# EAGLE schematic SIMPLE_Radio_AT86RF (EAGLE 6.5.0)
Zigbee Wireless Radio: AT86RF AT86RF Family <http://www.atmel.com/Images/doc8168.pdf> This block includes all supply bypass capacitors and RF coupling capacitors. The IRQ pin is optional. It tells the microcontroller when a new message has arrived among other things. The /RST pin can either be tied to power or be controlled by a microcontroller. The current antenna design calls for a whip (cut wire) antenna of length 8.33cm for 900MHz or 3.1cm for 2.4GHz to be soldered into the jumper.
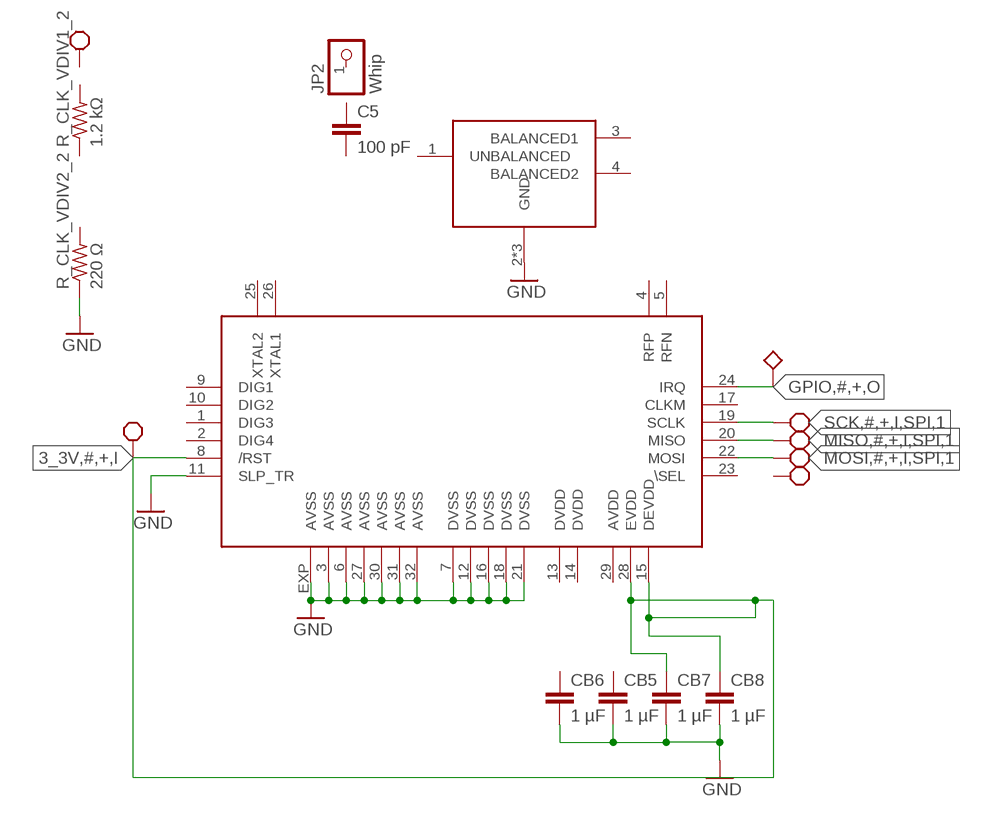
[diagram p0: schematic, sheet 1]

## Parts
BALUN2  0896FB15A0100  [0896FB15A0100]
C5  100 pF  C-EUC0402  [C0402]
CB5  1 µF  C-EUC0402  [C0402]
CB6  1 µF  C-EUC0402  [C0402]
CB7  1 µF  C-EUC0402  [C0402]
CB8  1 µF  C-EUC0402  [C0402]
JP2  Whip  PINHD-1X01_2.54-S  [1X01-S]
R_CLK_VDIV1_2  1.2 kΩ  R-US_R0402  [R0402]
R_CLK_VDIV2_2  220 Ω  R-US_R0402  [R0402]
U$51  AT86RF  [QFNN32]

## Nets
3_3V,#,+,I: CB7.1 CB8.1 U$51.8(/RST) U$51.15(DEVDD) U$51.28(EVDD) ; supply symbol labelled BLOCK_REQUIREMENT
GND: BALUN2.2(GND) BALUN2.5(GND) BALUN2.6(GND) CB5.2 CB6.2 CB7.2 CB8.2 R_CLK_VDIV2_2.1 U$51.3(AVSS) U$51.6(AVSS) U$51.7(DVSS) U$51.11(SLP_TR) U$51.12(DVSS) U$51.16(DVSS) U$51.18(DVSS) U$51.21(DVSS) U$51.27(AVSS) U$51.30(AVSS) U$51.31(AVSS) U$51.32(AVSS) U$51.EXP(AVSS)
GPIO,#,+,O: U$51.24(IRQ) ; supply symbol labelled BLOCK_RECOMMENDED
MISO,#,+,I,SPI,1: U$51.20(MISO) ; supply symbol labelled BLOCK_REQUIREMENT
MOSI,#,+,I,SPI,1: U$51.22(MOSI) ; supply symbol labelled BLOCK_REQUIREMENT
SCK,#,+,I,SPI,1: U$51.19(SCLK) ; supply symbol labelled BLOCK_REQUIREMENT
Unconnected: BALUN2.1(UNBALANCED) BALUN2.3(BALANCED1) BALUN2.4(BALANCED2) C5.1 C5.2 CB5.1 CB6.1 JP2.1 R_CLK_VDIV1_2.1 R_CLK_VDIV1_2.2 R_CLK_VDIV2_2.2 U$51.1(DIG3) U$51.2(DIG4) U$51.4(RFP) U$51.5(RFN) U$51.9(DIG1) U$51.10(DIG2) U$51.14(DVDD) U$51.17(CLKM) U$51.23(\SEL) U$51.25(XTAL2) U$51.26(XTAL1)

## Power pins joined to a net without a drawn wire
AVDD: U$51.29(AVDD)
DVDD: U$51.13(DVDD)

## Library data of the parts
BALUN2 = piccoli:0896FB15A0100
C5 CB5-CB8 = rcl:C-EU: CAPACITOR, European symbol
JP2 = pinhead-2:PINHD-1X01: PIN HEADER
R_CLK_VDIV1_2 R_CLK_VDIV2_2 = resistor:R-US_: RESISTOR, American symbol
U$51 = piccoli:AT86RF

## Net classes
4 xxwide: width 0.203 mm